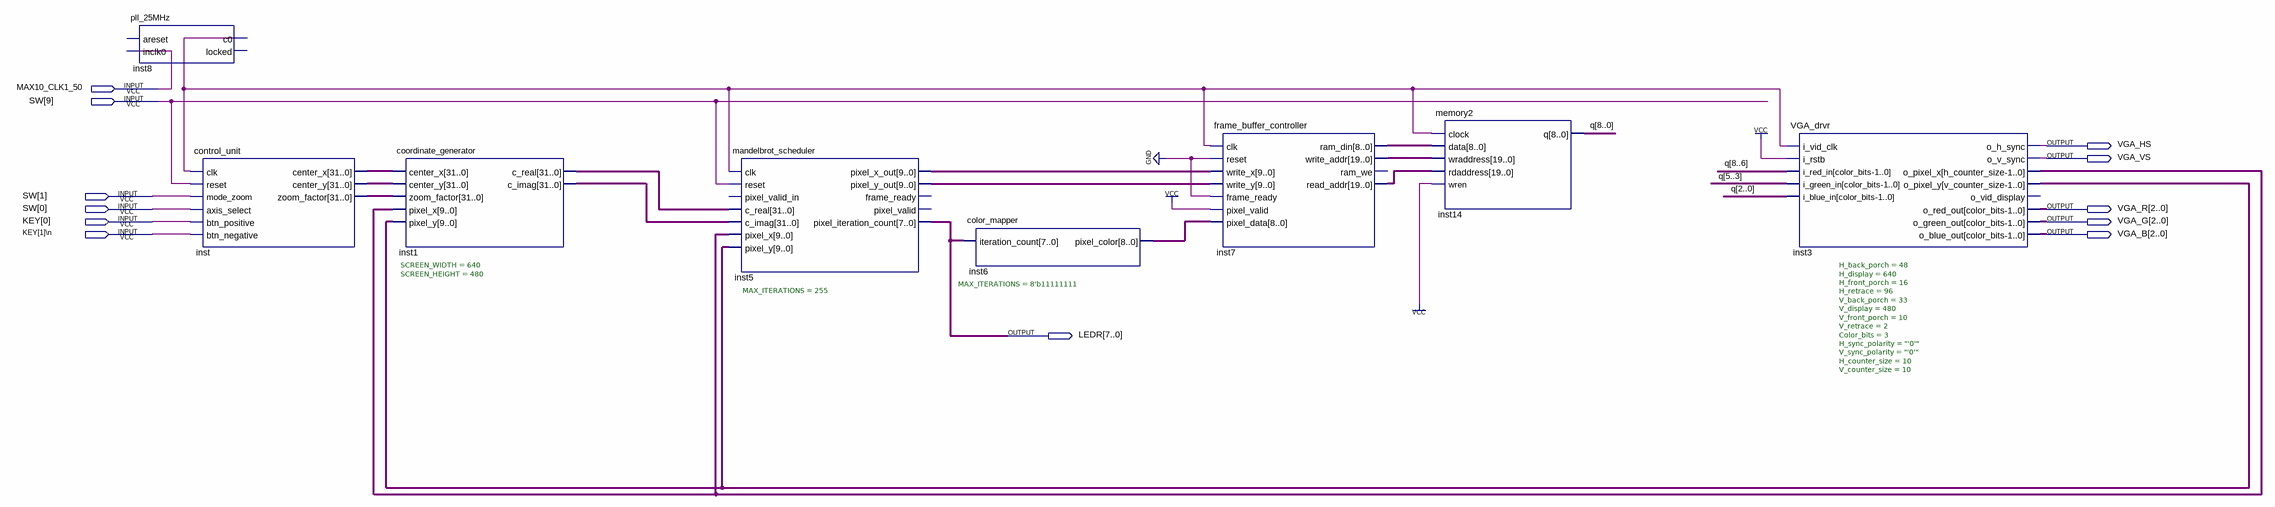
[diagram p0: schematic sheet]
// Quartus schematic FPGA_mandelbrot_explorer.bdf as structural Verilog: 8 symbols, 12 pins
module FPGA_mandelbrot_explorer (
  input  MAX10_CLK1_50,
  input  [9:0] SW,
  input  [0:0] KEY,
  input  \KEY[1]\n ,
  output VGA_HS,
  output VGA_VS,
  output [2:0] VGA_R,
  output [2:0] VGA_G,
  output [2:0] VGA_B,
  output [7:0] LEDR
);

  wire inst8_c0;
  wire [8:0] inst6_pixel_color, inst7_ram_din, q;
  wire [9:0] inst3_o_pixel_x, inst3_o_pixel_y, inst5_pixel_x_out, inst5_pixel_y_out;
  wire [19:0] inst7_read_addr, inst7_write_addr;
  wire [31:0] inst1_c_imag, inst1_c_real, inst_center_x, inst_center_y, inst_zoom_factor;

  pll_25MHz inst8 (.inclk0(MAX10_CLK1_50), .c0(inst8_c0));  // open: areset, locked
  control_unit inst (
    .clk(inst8_c0), .reset(SW[9]), .mode_zoom(SW[1]), .axis_select(SW[0]), .btn_positive(KEY[0]),
    .btn_negative(\KEY[1]\n ), .center_x(inst_center_x), .center_y(inst_center_y),
    .zoom_factor(inst_zoom_factor));
  coordinate_generator #(.SCREEN_WIDTH(640), .SCREEN_HEIGHT(480)) inst1 (
    .center_x(inst_center_x), .center_y(inst_center_y), .zoom_factor(inst_zoom_factor),
    .pixel_x(inst3_o_pixel_x), .pixel_y(inst3_o_pixel_y), .c_real(inst1_c_real), .c_imag(inst1_c_imag));
  mandelbrot_scheduler #(.MAX_ITERATIONS(255)) inst5 (
    .clk(inst8_c0), .reset(SW[9]), .c_real(inst1_c_real), .c_imag(inst1_c_imag), .pixel_x(inst3_o_pixel_x),
    .pixel_y(inst3_o_pixel_y), .pixel_x_out(inst5_pixel_x_out), .pixel_y_out(inst5_pixel_y_out),
    .pixel_iteration_count(LEDR));  // open: pixel_valid_in, frame_ready, pixel_valid
  color_mapper #(.MAX_ITERATIONS(8'b11111111)) inst6 (.iteration_count(LEDR), .pixel_color(inst6_pixel_color));
  frame_buffer_controller inst7 (
    .clk(inst8_c0), .reset(1'b0), .write_x(inst5_pixel_x_out), .write_y(inst5_pixel_y_out),
    .frame_ready(1'b0), .pixel_valid(1'b1), .pixel_data(inst6_pixel_color), .ram_din(inst7_ram_din),
    .write_addr(inst7_write_addr), .read_addr(inst7_read_addr));  // open: ram_we
  memory2 inst14 (
    .clock(inst8_c0), .data(inst7_ram_din), .wraddress(inst7_write_addr), .rdaddress(inst7_read_addr),
    .wren(1'b1), .q(q));
  VGA_drvr #(.H_back_porch(48), .H_display(640), .H_front_porch(16), .H_retrace(96), .V_back_porch(33), .V_display(480), .V_front_porch(10), .V_retrace(2), .Color_bits(3), .H_sync_polarity("'0'"), .V_sync_polarity("'0'"), .H_counter_size(10), .V_counter_size(10)) inst3 (
    .i_vid_clk(inst8_c0), .i_rstb(1'b1), .i_red_in(q[8:6]), .i_green_in(q[5:3]), .i_blue_in(q[2:0]),
    .o_h_sync(VGA_HS), .o_v_sync(VGA_VS), .o_pixel_x(inst3_o_pixel_x), .o_pixel_y(inst3_o_pixel_y),
    .o_red_out(VGA_R), .o_green_out(VGA_G), .o_blue_out(VGA_B));  // open: o_vid_display
endmodule
